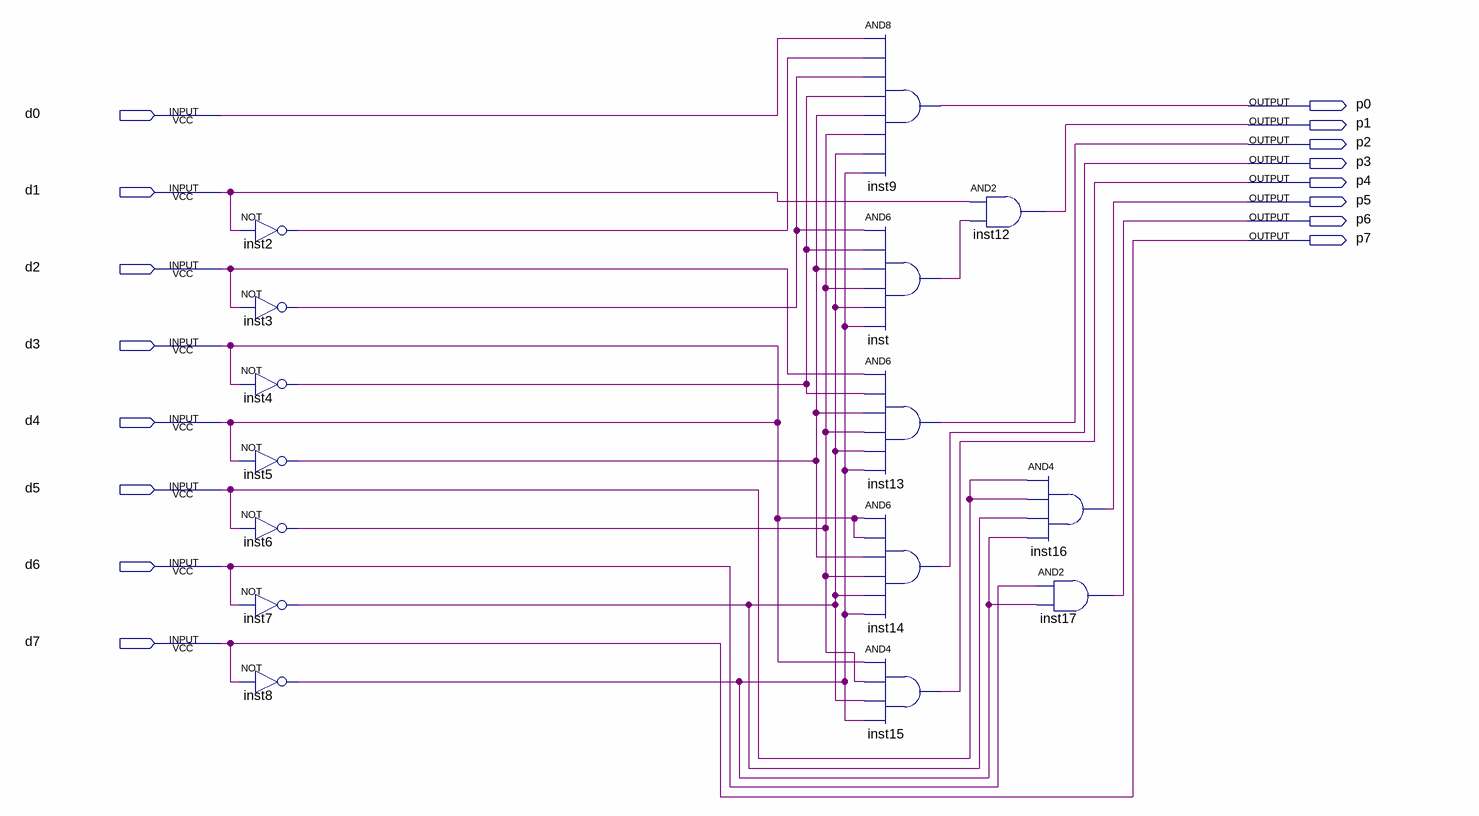
[diagram p0: schematic sheet]
// Quartus schematic Priority Encoder 83.bdf as structural Verilog: 15 symbols, 16 pins
module \Priority_Encoder_83  (
  input  d0,
  input  d1,
  input  d2,
  input  d3,
  input  d4,
  input  d5,
  input  d6,
  input  d7,
  output p0,
  output p1,
  output p2,
  output p3,
  output p4,
  output p5,
  output p6,
  output p7
);

  wire inst2_out, inst3_out, inst4_out, inst5_out, inst6_out, inst7_out, inst8_out, inst_out;

  not inst2 (inst2_out, d1);
  not inst3 (inst3_out, d2);
  not inst4 (inst4_out, d3);
  not inst5 (inst5_out, d3);
  not inst6 (inst6_out, d5);
  not inst7 (inst7_out, d6);
  not inst8 (inst8_out, d7);
  and inst9 (p0, d0, inst2_out, inst3_out, inst4_out, inst5_out, inst6_out, inst7_out, inst8_out);
  and inst (inst_out, inst3_out, inst4_out, inst5_out, inst6_out, inst7_out, inst8_out);
  and inst13 (p2, d2, inst4_out, inst5_out, inst6_out, inst7_out, inst8_out);
  and inst14 (p3, d3, d3, inst5_out, inst6_out, inst7_out, inst8_out);
  and inst15 (p4, d3, inst6_out, inst7_out, inst8_out);
  and inst12 (p1, d1, inst_out);
  and inst16 (p5, d5, d5, inst7_out, inst8_out);
  and inst17 (p6, d6, inst8_out);

  assign d4 = d3;
  assign p7 = d7;
endmodule
